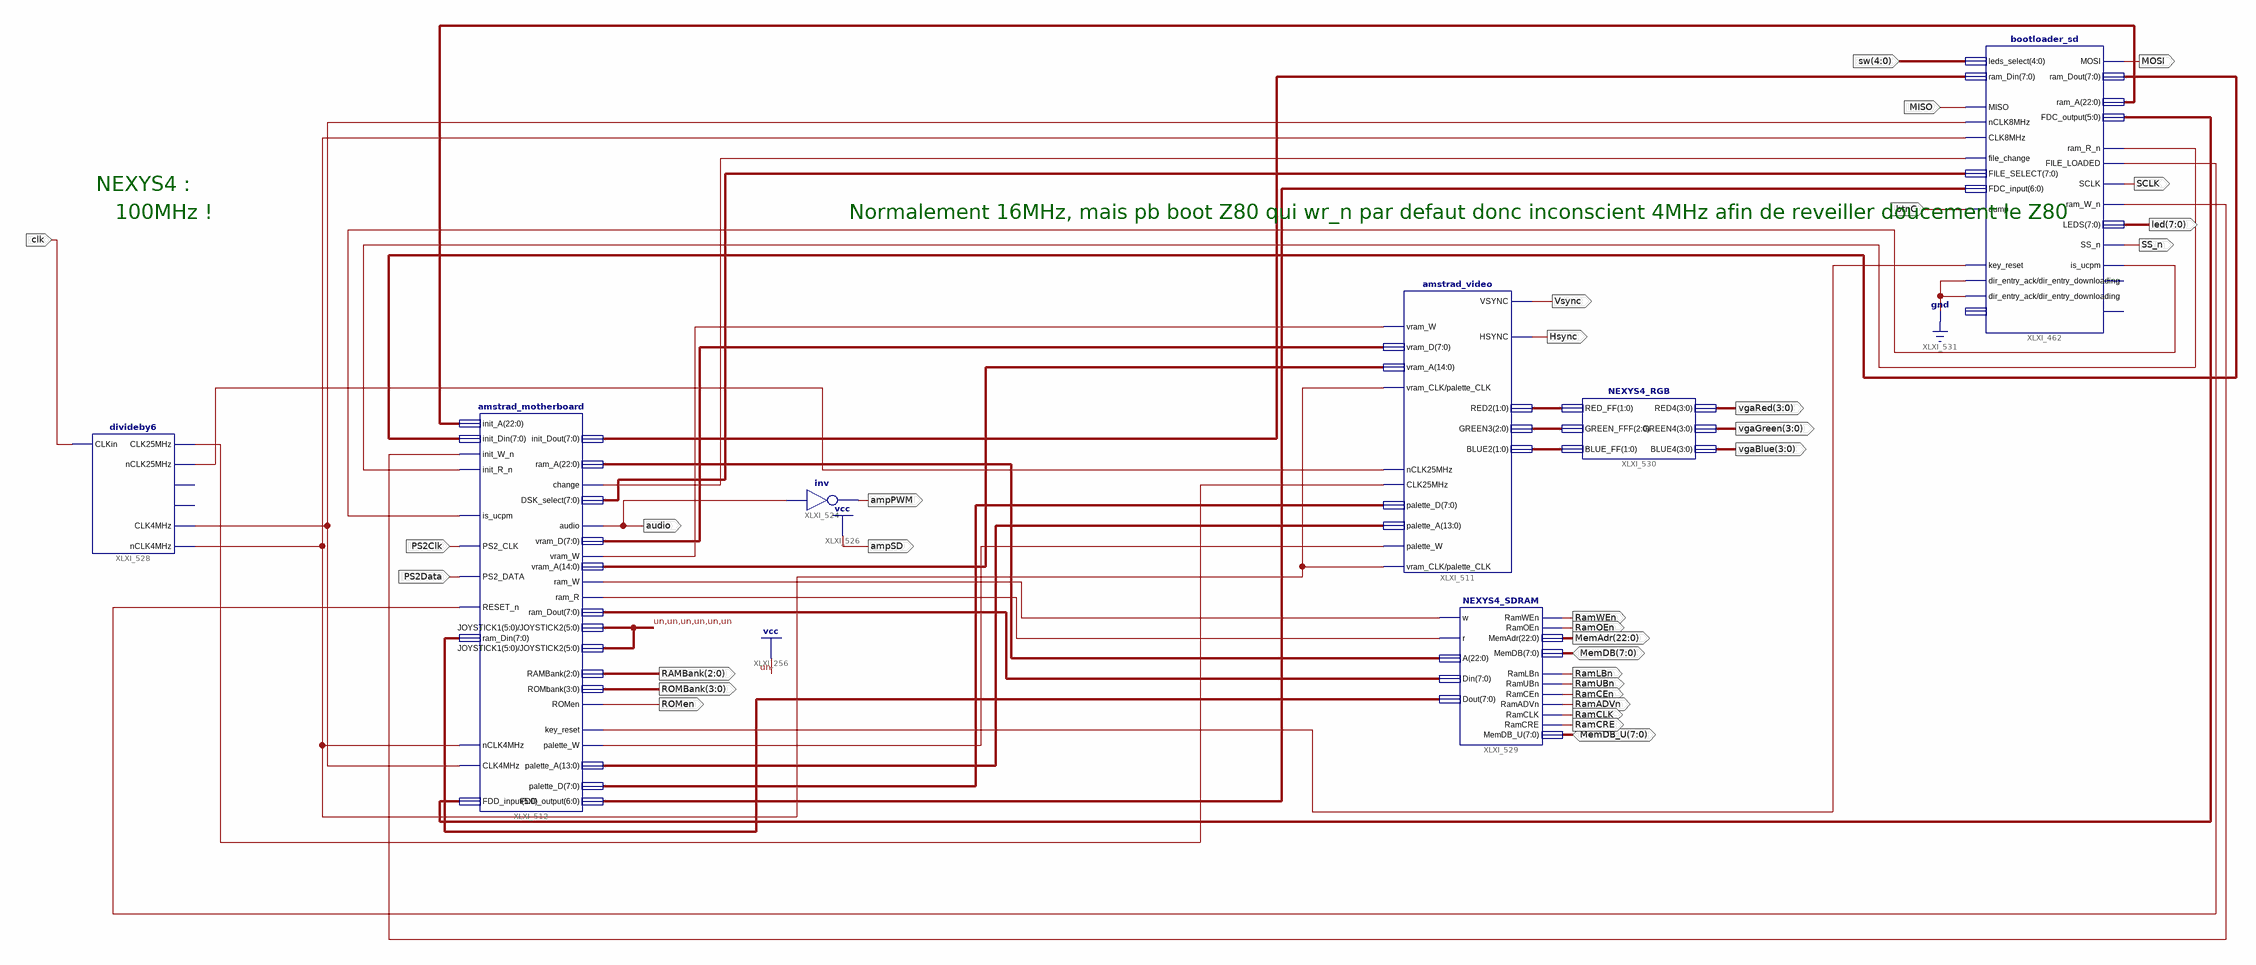
[diagram p0: schematic sheet 1]
// Xilinx ISE schematic amstrad_switch_z80_vga_sd.sch (artix7) as structural Verilog: 7 symbols, 32 ports
module amstrad_switch_z80_vga_sd (
  input  clk,
  input  MISO,
  input  btnC,
  input  [4:0] sw,
  input  PS2Clk,
  input  PS2Data,
  inout  [7:0] MemDB,
  inout  [7:0] MemDB_U,
  output MOSI,
  output SCLK,
  output SS_n,
  output Vsync,
  output Hsync,
  output audio,
  output [2:0] RAMBank,
  output [3:0] ROMBank,
  output ROMen,
  output [7:0] led,
  output ampPWM,
  output ampSD,
  output RamWEn,
  output RamOEn,
  output [22:0] MemAdr,
  output RamLBn,
  output RamUBn,
  output RamCEn,
  output RamADVn,
  output RamCLK,
  output RamCRE,
  output [3:0] vgaGreen,
  output [3:0] vgaRed,
  output [3:0] vgaBlue
);

  wire CLK4MHz, clk25MHz, nCLK4MHz, nCLK25MHz, RESET_n, XLXN_736, XLXN_753, XLXN_770, XLXN_787, XLXN_789,
       XLXN_796, XLXN_797, XLXN_836, XLXN_837;
  wire [1:0] XLXN_831, XLXN_833;
  wire [2:0] XLXN_832;
  wire [5:0] XLXN_791;
  wire [6:0] XLXN_790;
  wire [7:0] XLXN_759, XLXN_771, XLXN_788, XLXN_799, XLXN_800, XLXN_801, XLXN_834;
  wire [13:0] XLXN_772;
  wire [14:0] XLXN_760;
  wire [22:0] XLXN_737, XLXN_798;

  amstrad_video XLXI_511 (
    .vram_W(XLXN_753), .vram_D(XLXN_759), .vram_A(XLXN_760), .vram_CLK(nCLK4MHz), .CLK25MHz(clk25MHz),
    .palette_W(XLXN_770), .palette_D(XLXN_771), .palette_A(XLXN_772), .palette_CLK(nCLK4MHz),
    .nCLK25MHz(nCLK25MHz), .HSYNC(Hsync), .VSYNC(Vsync), .RED2(XLXN_831), .BLUE2(XLXN_833), .GREEN3(XLXN_832));
  amstrad_motherboard #(.KEEP_HIERARCHY("TRUE")) XLXI_512 (
    .init_A(XLXN_737), .CLK4MHz(CLK4MHz), .nCLK4MHz(nCLK4MHz), .is_ucpm(XLXN_836), .RESET_n(RESET_n),
    .PS2_DATA(PS2Data), .PS2_CLK(PS2Clk), .FDD_input(XLXN_791), .init_R_n(XLXN_837), .init_W_n(XLXN_736),
    .init_Din(XLXN_834), .ram_Din(XLXN_800), .JOYSTICK1({6{1'b1}}), .JOYSTICK2({6{1'b1}}), .RAMBank(RAMBank),
    .ROMbank(ROMBank), .ram_A(XLXN_798), .audio(audio), .vram_D(XLXN_759), .palette_A(XLXN_772),
    .palette_D(XLXN_771), .vram_W(XLXN_753), .vram_A(XLXN_760), .ROMen(ROMen), .ram_W(XLXN_796),
    .palette_W(XLXN_770), .ram_R(XLXN_797), .key_reset(XLXN_787), .change(XLXN_789), .DSK_select(XLXN_788),
    .FDD_output(XLXN_790), .init_Dout(XLXN_801), .ram_Dout(XLXN_799));
  not XLXI_524 (ampPWM, audio);
  divideby6 XLXI_528 (
    .CLKin(clk), .CLK25MHz(clk25MHz), .nCLK4MHz(nCLK4MHz), .nCLK25MHz(nCLK25MHz), .CLK4MHz(CLK4MHz));  // open: CLK8MHz, nCLK8MHz
  NEXYS4_SDRAM XLXI_529 (
    .w(XLXN_796), .r(XLXN_797), .A(XLXN_798), .Din(XLXN_799), .RamWEn(RamWEn), .Dout(XLXN_800),
    .MemDB_U(MemDB_U), .RamOEn(RamOEn), .MemAdr(MemAdr), .MemDB(MemDB), .RamLBn(RamLBn), .RamUBn(RamUBn),
    .RamCEn(RamCEn), .RamADVn(RamADVn), .RamCLK(RamCLK), .RamCRE(RamCRE));
  NEXYS4_RGB XLXI_530 (
    .RED_FF(XLXN_831), .GREEN_FFF(XLXN_832), .BLUE_FF(XLXN_833), .RED4(vgaRed), .GREEN4(vgaGreen),
    .BLUE4(vgaBlue));
  bootloader_sd XLXI_462 (
    .MISO(MISO), .FILE_SELECT(XLXN_788), .CLK8MHz(nCLK4MHz), .nCLK8MHz(CLK4MHz), .dump(btnC),
    .leds_select(sw), .key_reset(XLXN_787), .file_change(XLXN_789), .FDC_input(XLXN_790), .ram_Din(XLXN_801),
    .dir_entry_ack(1'b0), .dir_entry_downloading(1'b0), .MOSI(MOSI), .ram_A(XLXN_737), .SCLK(SCLK),
    .is_ucpm(XLXN_836), .FILE_LOADED(RESET_n), .ram_W_n(XLXN_736), .LEDS(led), .SS_n(SS_n),
    .FDC_output(XLXN_791), .ram_Dout(XLXN_834), .ram_R_n(XLXN_837));  // open: dir_entry_clk, dir_entry_d, dir_entry_r

  assign ampSD = 1'b1;

  // Notes on the sheet:
  //   NEXYS4 :
  //   100MHz !
  //   Normalement 16MHz, mais pb boot Z80 qui wr_n par defaut donc inconscient 4MHz afin de reveiller doucement le Z80
endmodule
